# Altium project Bluetooth_Can.PrjPCB
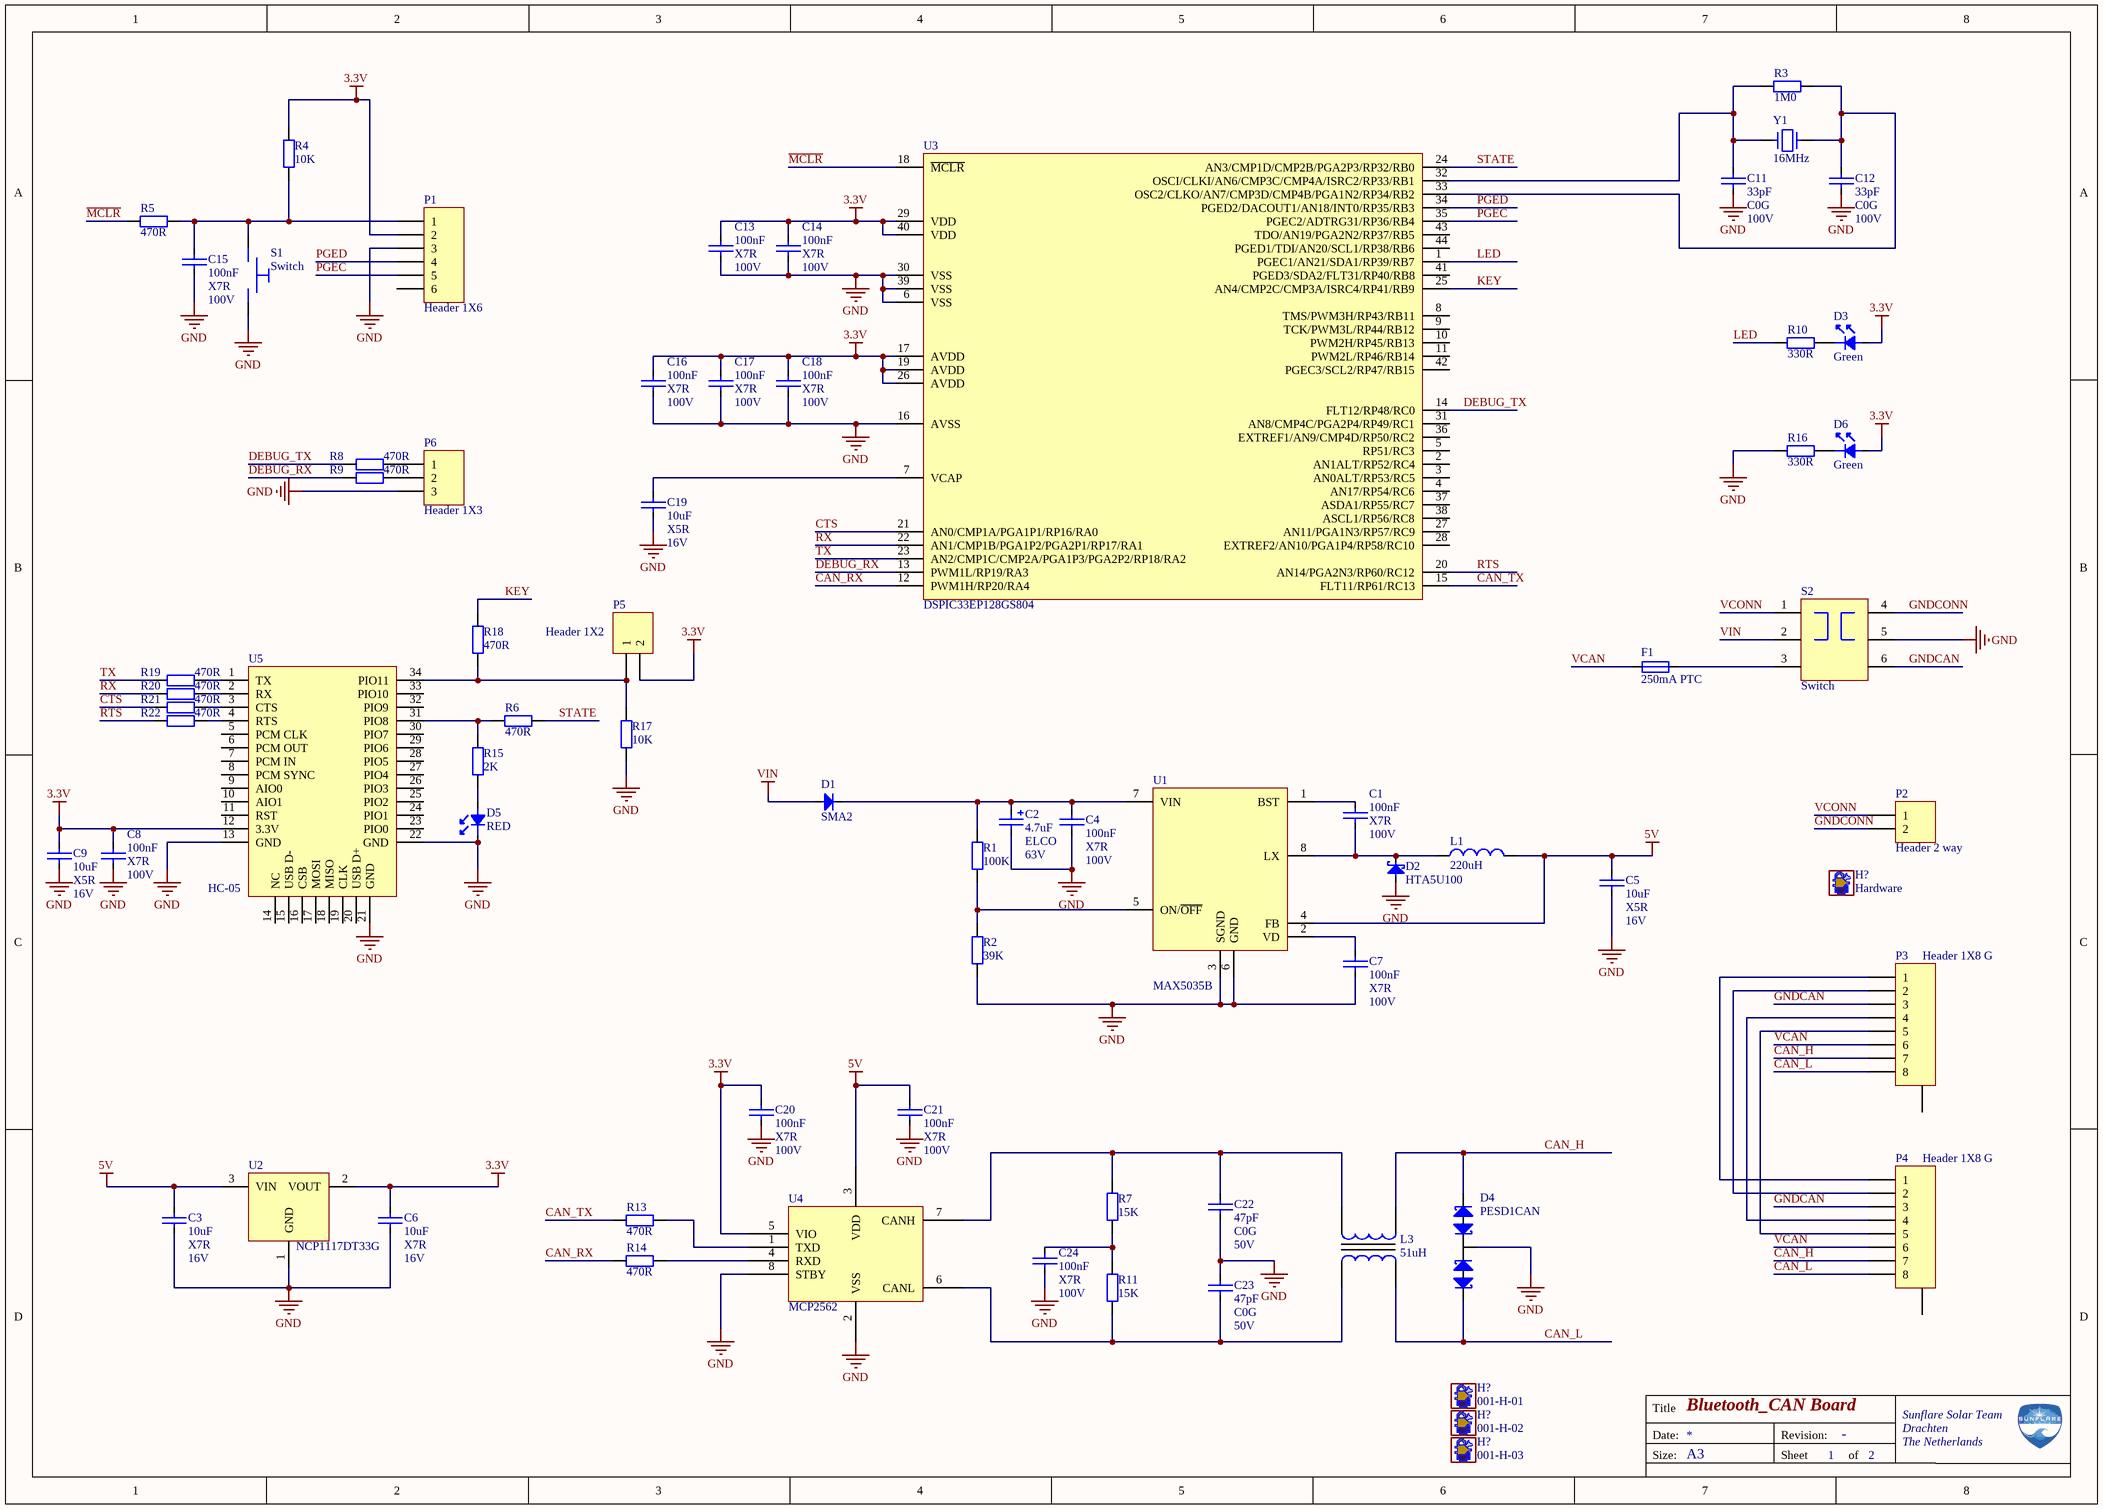
[diagram p0: Bluetooth_CAN.SchDoc]
1 sheet, 71 parts. Net scope: global (net labels, ports and power ports of the same name join across sheets).
Board file: Bluetooth_CAN.PcbDoc

## Sheet Bluetooth_CAN.SchDoc: Bluetooth_CAN Board
size A3; Organization: Sunflare Solar Team; Address1: Drachten; Address2: The Netherlands; Revision: -; SheetNumber: 1; SheetTotal: 2

### Parts
(Parts that share a designator on the sheet are numbered #1, #2 ... from top to bottom, then left to right.)
C1  100nF  Dielectric: X7R  VoltageRating: 100V  [CAP0805]
C2  4.7uF  Dielectric: ELCO  VoltageRating: 63V  [CAPPOL5MM]
C3  10uF  Dielectric: X7R  VoltageRating: 16V  [CAP1210]
C4  100nF  Dielectric: X7R  VoltageRating: 100V  [CAP0805]
C5  10uF  Dielectric: X5R  VoltageRating: 16V  [CAP1210]
C6  10uF  Dielectric: X7R  VoltageRating: 16V  [CAP1210]
C7  100nF  Dielectric: X7R  VoltageRating: 100V  [CAP0805]
C8  100nF  Dielectric: X7R  VoltageRating: 100V  [CAP0805]
C9  10uF  Dielectric: X5R  VoltageRating: 16V  [CAP1210]
C11  33pF  Dielectric: C0G  VoltageRating: 100V  [CAP0805]
C12  33pF  Dielectric: C0G  VoltageRating: 100V  [CAP0805]
C13  100nF  Dielectric: X7R  VoltageRating: 100V  [CAP0805]
C14  100nF  Dielectric: X7R  VoltageRating: 100V  [CAP0805]
C15  100nF  Dielectric: X7R  VoltageRating: 100V  [CAP0805]
C16  100nF  Dielectric: X7R  VoltageRating: 100V  [CAP0805]
C17  100nF  Dielectric: X7R  VoltageRating: 100V  [CAP0805]
C18  100nF  Dielectric: X7R  VoltageRating: 100V  [CAP0805]
C19  10uF  Dielectric: X5R  VoltageRating: 16V  [CAP1210]
C20  100nF  Dielectric: X7R  VoltageRating: 100V  [CAP0805]
C21  100nF  Dielectric: X7R  VoltageRating: 100V  [CAP0805]
C22  47pF  Dielectric: C0G  VoltageRating: 50V  [CAP0805]
C23  47pF  Dielectric: C0G  VoltageRating: 50V  [CAP0805]
C24  100nF  Dielectric: X7R  VoltageRating: 100V  [CAP0805]
D1  SMA2  [DIODEDO-214AC]
D2  HTA5U100  [DIODEDO-214AC]
D3  Green  [LEDTHT]
D4  PESD1CAN  [SOT23-3N]
D5  RED  [LEDTHT]
D6  Green  [LEDTHT]
F1  250mA PTC  [Fuse 1206]
H?#1  Hardware
H?#2  001-H-01
H?#3  001-H-02
H?#4  001-H-03
L1  220uH  [INDWE-PD]
L3  51uH  [IND200P450X300-4N]
P1  Header 1X6  [Header1X6P100_Program]  (no BOM)
P2  Header 2 way  [21.95MH/2-E]
P3  Header 1X8 G  [TECO-1-406541-5]
P4  Header 1X8 G  [TECO-1-406541-5]
P5  Header 1X2  [Header1X2P100]  (no BOM)
P6  Header 1X3  [Header1X3P100]  (no BOM)
R1  100K  [RES0603]
R2  39K  [RES0603]
R3  1M0  [RES0603]
R4  10K  [RES0603]
R5  470R  [RES0603]
R6  470R  [RES0603]
R7  15K  [RES0603]
R8  470R  [RES0603]
R9  470R  [RES0603]
R10  330R  [RES0603]
R11  15K  [RES0603]
R13  470R  [RES0603]
R14  470R  [RES0603]
R15  2K  [RES0603]
R16  330R  [RES0603]
R17  10K  [RES0603]
R18  470R  [RES0603]
R19  470R  [RES0603]
R20  470R  [RES0603]
R21  470R  [RES0603]
R22  470R  [RES0603]
S1  Switch  [SWITCHTE1825027-2]
S2  Switch  [JS202011AQN]
U1  MAX5035B  [SOIC-8N]
U2  NCP1117DT33G  [DPAK-3]
U3  DSPIC33EP128GS804  [TQFP80P1200X1200X120-44N]
U4  MCP2562  [SOIC-8N]
U5  HC-05  [HC-05]
Y1  16MHz  [XT49M-2016M]

### Nets
3.3V: C6.2 C8.2 C9.2 C13.2 C14.2 C16.2 C17.2 C18.2 C20.2 D3.2(A) D6.2(A) P1.2 P5.2 R4.1 U2.2(VOUT) U3.17(AVDD) U3.19(AVDD) U3.26(AVDD) U3.29(VDD) U3.40(VDD) U4.5(VIO) U5.12(3.3V)
5V: C3.2 C5.2 C21.2 L1.2 U1.4(FB) U2.3(VIN) U4.3(VDD)
GND: C2.2 C3.1 C4.1 C5.1 C6.1 C7.1 C8.1 C9.1 C11.1 C12.1 C13.1 C14.1 C15.2 C16.1 C17.1 C18.1 C19.1 C20.1 C21.1 C22.1 C23.2 C24.1 D2.2(A) D4.3 D5.1(K) P1.3 P6.3 R2.2 R16.1 R17.1 S1.2 S2.5 U1.3(SGND) U1.6(GND) U2.1(GND) U3.6(VSS) U3.16(AVSS) U3.30(VSS) U3.39(VSS) U4.2(VSS) U4.8(STBY) U5.13(GND) U5.21(GND) U5.22(GND)
VIN: D1.2(A) S2.2
CAN_H: D4.1 L3.2 P3.7 P4.7
CAN_L: D4.2 L3.3 P3.8 P4.8
CAN_RX: R14.1 U3.12(PWM1H/RP20/RA4)
CAN_TX: R13.1 U3.15(FLT11/RP61/RC13)
CTS: R21.1 U3.21(AN0/CMP1A/PGA1P1/RP16/RA0)
DEBUG_RX: R9.1 U3.13(PWM1L/RP19/RA3)
DEBUG_TX: R8.1 U3.14(FLT12/RP48/RC0)
GNDCAN: P3.3 P4.3 S2.6
GNDCONN: P2.2 S2.4
KEY: R18.2 U3.25(AN4/CMP2C/CMP3A/ISRC4/RP41/RB9)
LED: R10.1 U3.1(PGEC1/AN21/SDA1/RP39/RB7)
~{MCLR}: R5.1 U3.18(~{MCLR})
PGEC: P1.5 U3.35(PGEC2/ADTRG31/RP36/RB4)
PGED: P1.4 U3.34(PGED2/DACOUT1/AN18/INT0/RP35/RB3)
RTS: R22.1 U3.20(AN14/PGA2N3/RP60/RC12)
RX: R20.1 U3.22(AN1/CMP1B/PGA1P2/PGA2P1/RP17/RA1)
STATE: R6.2 U3.24(AN3/CMP1D/CMP2B/PGA2P3/RP32/RB0)
TX: R19.1 U3.23(AN2/CMP1C/CMP2A/PGA1P3/PGA2P2/RP18/RA2)
VCAN: F1.1 P3.6 P4.6
VCONN: P2.1 S2.1
NetC1_1: C1.1 D2.1(K) L1.1 U1.8(LX)
NetC1_2: C1.2 U1.1(BST)
NetC2_1: C2.1 C4.2 D1.1(K) R1.1 U1.7(VIN)
NetC7_2: C7.2 U1.2(VD)
NetC11_2: C11.2 R3.1 U3.32(OSCI/CLKI/AN6/CMP3C/CMP4A/ISRC2/RP33/RB1) Y1.1
NetC12_2: C12.2 R3.2 U3.33(OSC2/CLKO/AN7/CMP3D/CMP4B/PGA1N2/RP34/RB2) Y1.2
NetC15_1: C15.1 P1.1 R4.2 R5.2 S1.1
NetC19_2: C19.2 U3.7(VCAP)
NetC22_2: C22.2 L3.1 R7.1 U4.7(CANH)
NetC23_1: C23.1 L3.4 R11.2 U4.6(CANL)
NetC24_2: C24.2 R7.2 R11.1
NetD3_1: D3.1(K) R10.2
NetD5_2: D5.2(A) R15.2
NetD6_1: D6.1(K) R16.2
NetF1_2: F1.2 S2.3
NetP3_1: P3.1 P4.1
NetP3_2: P3.2 P4.2
NetP3_4: P3.4 P4.4
NetP3_5: P3.5 P4.5
NetP5_1: P5.1 R17.2 R18.1 U5.34(PIO11)
NetP6_1: P6.1 R8.2
NetP6_2: P6.2 R9.2
NetR1_2: R1.2 R2.1 U1.5(ON/~{OFF})
NetR6_1: R6.1 R15.1 U5.31(PIO8)
NetR13_2: R13.2 U4.1(TXD)
NetR14_2: R14.2 U4.4(RXD)
NetR19_2: R19.2 U5.1(TX)
NetR20_2: R20.2 U5.2(RX)
NetR21_2: R21.2 U5.3(CTS)
NetR22_2: R22.2 U5.4(RTS)

Not connected (* = marked no-connect by the designer): P1 6; P3 9(G); P4 9(G); U3 2(AN1ALT/RP52/RC4) 3(AN0ALT/RP53/RC5) 4(AN17/RP54/RC6) 5(RP51/RC3) 8(TMS/PWM3H/RP43/RB11) 9(TCK/PWM3L/RP44/RB12) 10(PWM2H/RP45/RB13) 11(PWM2L/RP46/RB14) 27(AN11/PGA1N3/RP57/RC9) 28(EXTREF2/AN10/PGA1P4/RP58/RC10) 31(AN8/CMP4C/PGA2P4/RP49/RC1) 36(EXTREF1/AN9/CMP4D/RP50/RC2) 37(ASDA1/RP55/RC7) 38(ASCL1/RP56/RC8) 41(PGED3/SDA2/FLT31/RP40/RB8) 42(PGEC3/SCL2/RP47/RB15) 43(TDO/AN19/PGA2N2/RP37/RB5) 44(PGED1/TDI/AN20/SCL1/RP38/RB6); U5 5(PCM_CLK) 6(PCM_OUT) 7(PCM_IN) 8(PCM_SYNC) 9(AIO0) 10(AIO1) 11(RST) 14(NC) 15(USB_D-) 16(CSB) 17(MOSI) 18(MISO) 19(CLK) 20(USB_D+) 23(PIO0) 24(PIO1) 25(PIO2) 26(PIO3) 27(PIO4) 28(PIO5) 29(PIO6) 30(PIO7) 32(PIO9) 33(PIO10)

### Notes on the sheet
- Title
- Size:
- Date:
- A3
- Revision:
- Sheet
- of

### Library data of the parts
C1 C4 C7 C8 C11-C18 C20-C24 = Capacitor: Manufacturer: -; Manufacturer Part No: -; Farnell Ordercode: -; Price: 0.00
C2 = CapacitorPol: Capacitor Pol; Manufacturer: WURTH ELEKTRONIK; Manufacturer Part No: 865060742001; Farnell Ordercode: 2837323; Price: 0.33
C3 C6 = Capacitor: Manufacturer: TDK; Manufacturer Part No: C3225X7R1C106K200AB; Farnell Ordercode: 2112722; Price: 1.35
C5 C9 C19 = Capacitor: Manufacturer: Multicomp; Manufacturer Part No: MC1210X106K160CT; Farnell Ordercode: 1759465; Price: 0.50
D1 = Diode: Manufacturer: Multicomp; Manufacturer Part No: S2MA; Farnell Ordercode: 2675071; Price: 0.13
D2 = Diode Schottky: Manufacturer: Multicomp; Manufacturer Part No: HTA5U100; Farnell Ordercode: 2750942; Price: 0.46
D3 D6 = Led: Manufacturer: Multicomp; Manufacturer Part No: MCL034GT; Farnell Ordercode: 1581123; Price: 0.08
D4 = PESD1CAN: ESD Protection Device, TVS, 70 V, SOT-23, 3 Pins; Manufacturer: NXP; Manufacturer Part No: PESD1CAN; Farnell Ordercode: 1510703; Price: 0.13
D5 = Led: Manufacturer: Multicomp; Manufacturer Part No: MCL034PT; Farnell Ordercode: 1581121; Price: 0.06
F1 = Fuse: Manufacturer: EATON BUSSMANN SERIES; Manufacturer Part No: PTS120660V010; Farnell Ordercode: 2929345; Price: 0.26
H?#1 = Hardware: Generaric hardware; Manufacturer: IMO PRECISION CONTROLS; Manufacturer Part No: 21.950M/2-E; Farnell Ordercode: 2575233; Price: 0.37
H?#2 = Hardware: PCB; Manufacturer: -; Manufacturer Part No: -; Farnell Ordercode: -; Price: 2.00
H?#3 = Hardware: Casing bottom; Manufacturer: -; Manufacturer Part No: -; Farnell Ordercode: -; Price: 2.50
H?#4 = Hardware: Casing top; Manufacturer: -; Manufacturer Part No: -; Farnell Ordercode: -; Price: 2.50
L1 = Inductor: Manufacturer: WE; Manufacturer Part No: 744777222; Farnell Ordercode: 2761710; Price: 0.971
L3 = Choke Common Mode: Manufacturer: Bourns; Manufacturer Part No: SRF4532-510Y; Farnell Ordercode: 2859108; Price: 0.47
P1 = Header1X6: Connector 1X6; Manufacturer: -; Manufacturer Part No: -; Farnell Ordercode: -; Price: 0.00
P2 = Header1X2: Manufacturer: IMO PRECISION CONTROLS; Manufacturer Part No: 21.95MH/2-E; Farnell Ordercode: 2517885; Price: 0.15
P3 P4 = Header1X8+G: Connector 1X8 with Ground; Manufacturer: -; Manufacturer Part No: -; Farnell Ordercode: -; Price: 0.00
P5 = Header1X2: Connector 1X2; Manufacturer: -; Manufacturer Part No: -; Farnell Ordercode: -; Price: 0.00
P6 = Header1X3: Connector 1X3; Manufacturer: -; Manufacturer Part No: -; Farnell Ordercode: -; Price: 0.00
R1-R11 R13-R22 = Resistor: Tolerance: 1%; Manufacturer: -; Manufacturer Part No: -; Farnell Ordercode: -; Price: 0.00
S1 = TactileSwitch: Tactile Switch; Manufacturer: TE CONNECTIVITY; Manufacturer Part No: FSMRA4JH; Farnell Ordercode: 1555988; Price: 0.15
S2 = DPDTSwitch: Tactile Switch; Manufacturer: C&K COMPONENTS; Manufacturer Part No: JS202011AQN; Farnell Ordercode: 2435145; Price: 0.31
U1 = MAX5035B: 5V 1A, 76V, High-Efficiency MAXPower Step-Down DC-DC Converter; Manufacturer: Maxim Integrated Products; Manufacturer Part No: MAX5035BUSA+T; Farnell Ordercode: 2799102; Price: 3.26
U2 = NCP1117DT33G: Fixed LDO Voltage Regulator, 20V in, 1.07V Dropout, 3.3V/1A out, DPAK-3; Manufacturer: ON SEMICONDUCTOR; Manufacturer Part No: NCP1117DT33G; Farnell Ordercode: 1652364; Price: 0.37
U3 = DSPIC33EP128GS804: 16-Bit Digital Signal Controllers fo  r Digital Power Applications with   Interconnected High-Speed PWM, ADC, PGA and Comparators; Manufacturer: Microchip; Manufacturer Part No: DSPIC33EP128GS804-I/PT; Farnell Ordercode: 2706170; Price: 4.44
U4 = MCP2562: CAN Bus, Transceiver, CAN, LIN, 1, 1, 4.5 V, 5.5 V, SOIC; Manufacturer: Microchip; Manufacturer Part No: MCP2562-E/SN; Farnell Ordercode: 2362839; price: 0.79
U5 = HC-05: Bluetooth Module; Manufacturer: N/A; Manufacturer Part No: HC-05; Farnell Ordercode: N/A; Price: 4.00; TME Ordercode: HC-05
Y1 = Crystal: Manufacturer: Multicomp; Manufacturer Part No: MCRSD16000F183000RR; Farnell Ordercode: 2395958; Price: 0.19